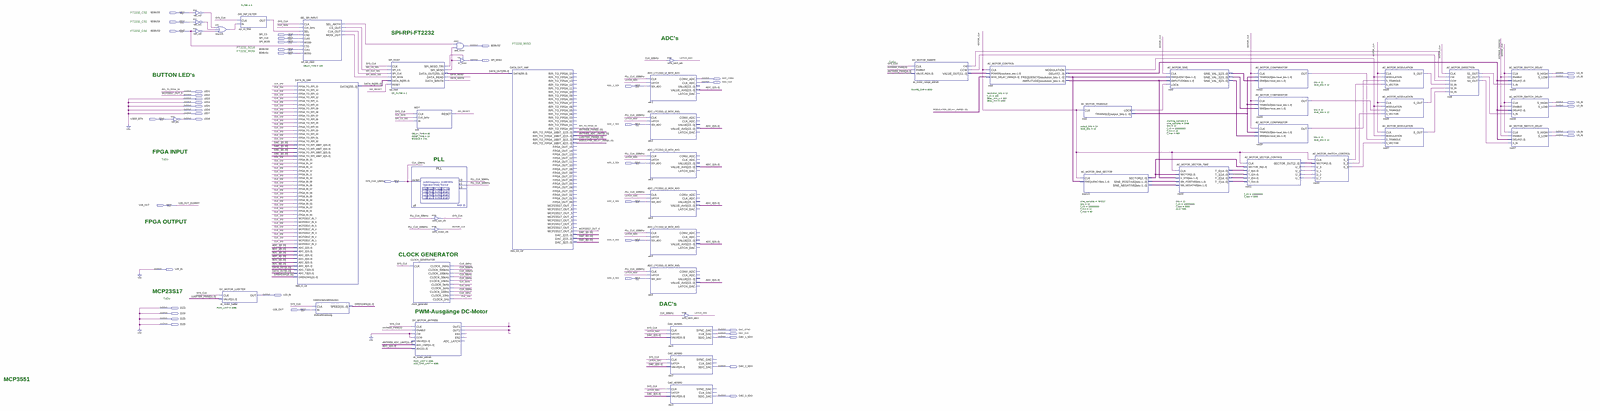
[diagram p0: schematic sheet, whole]
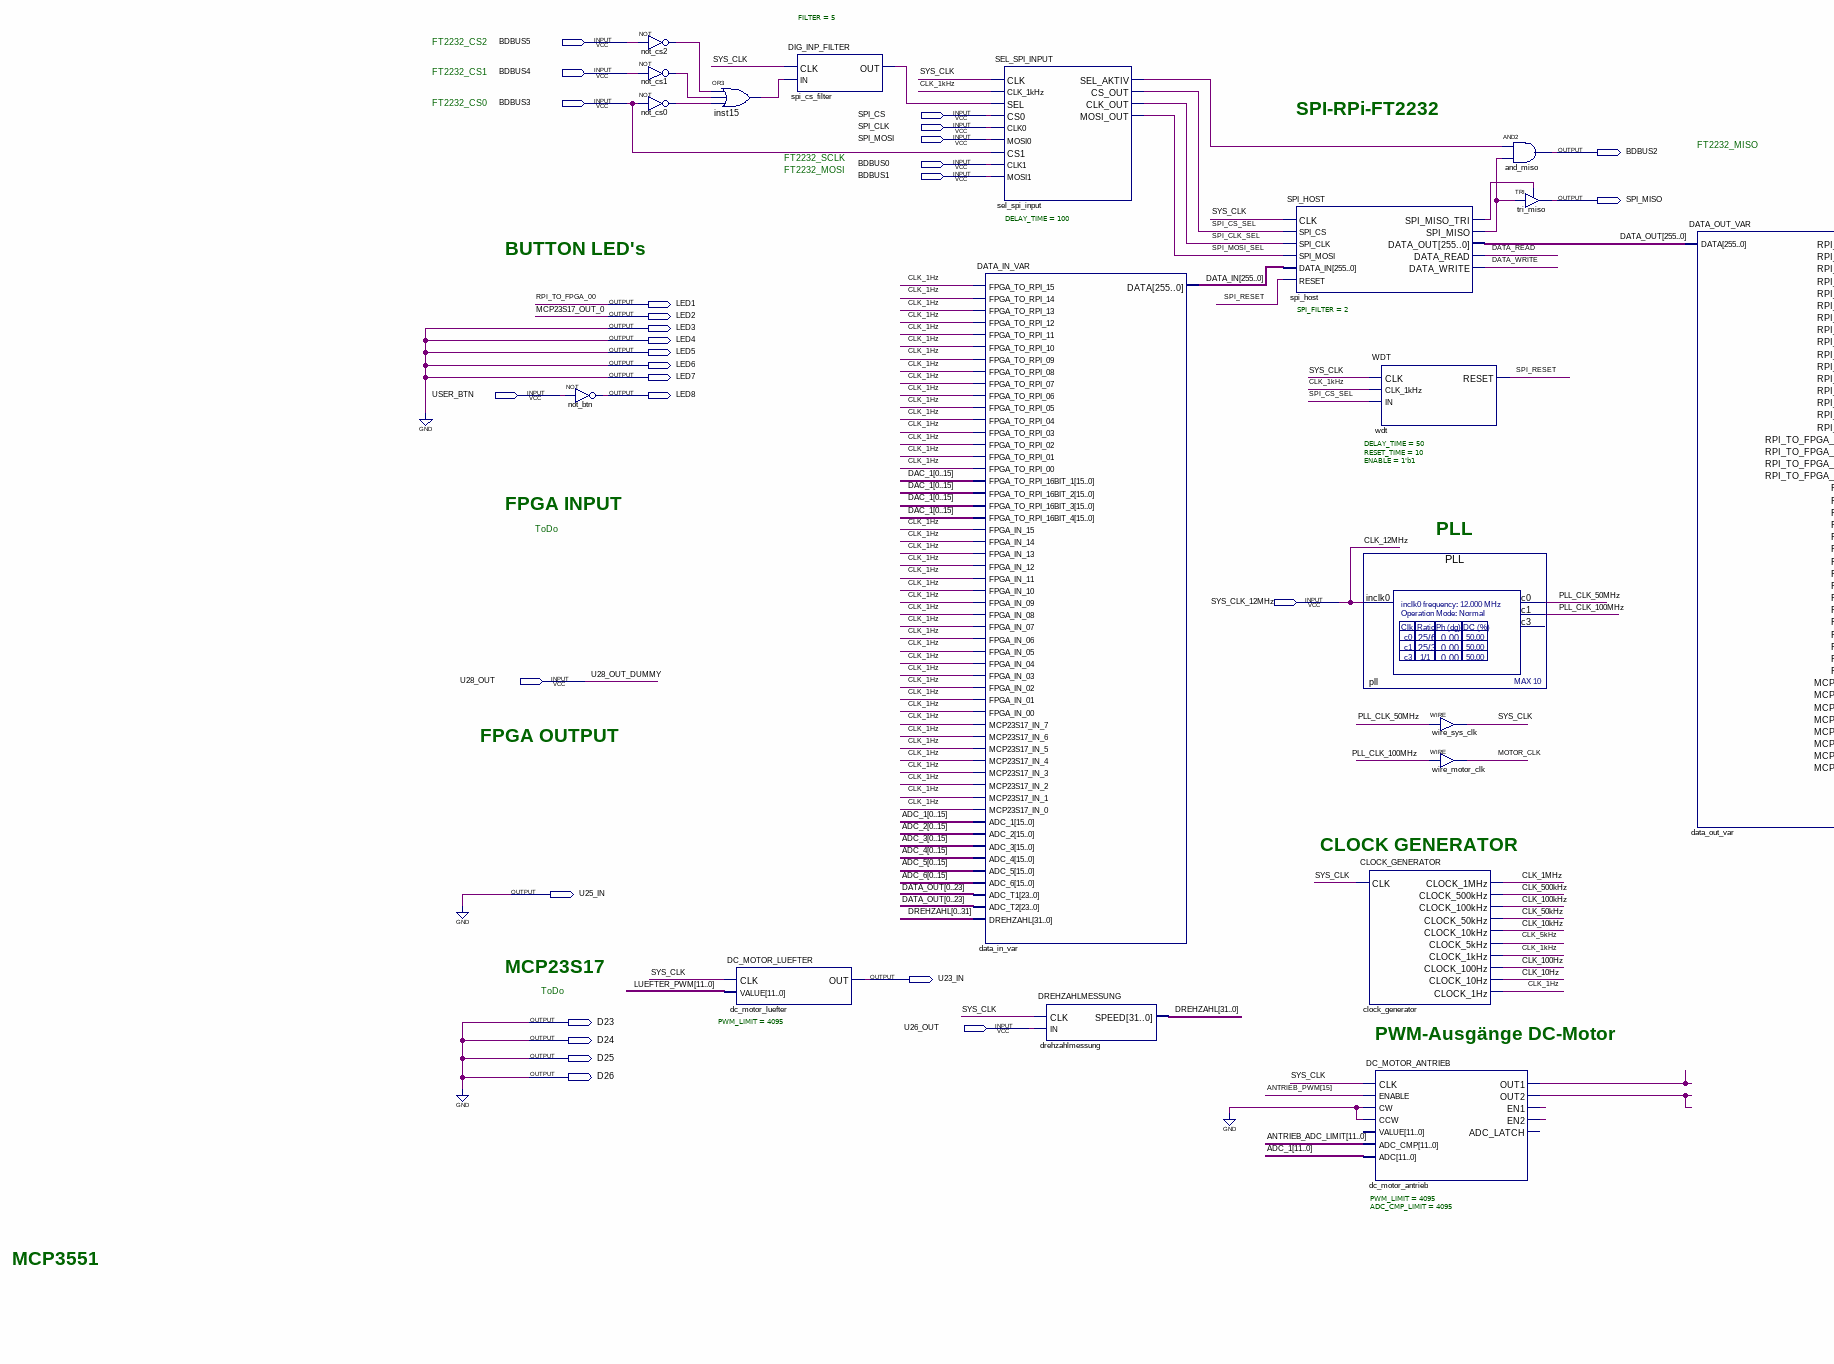
[diagram p1: schematic sheet, left part]
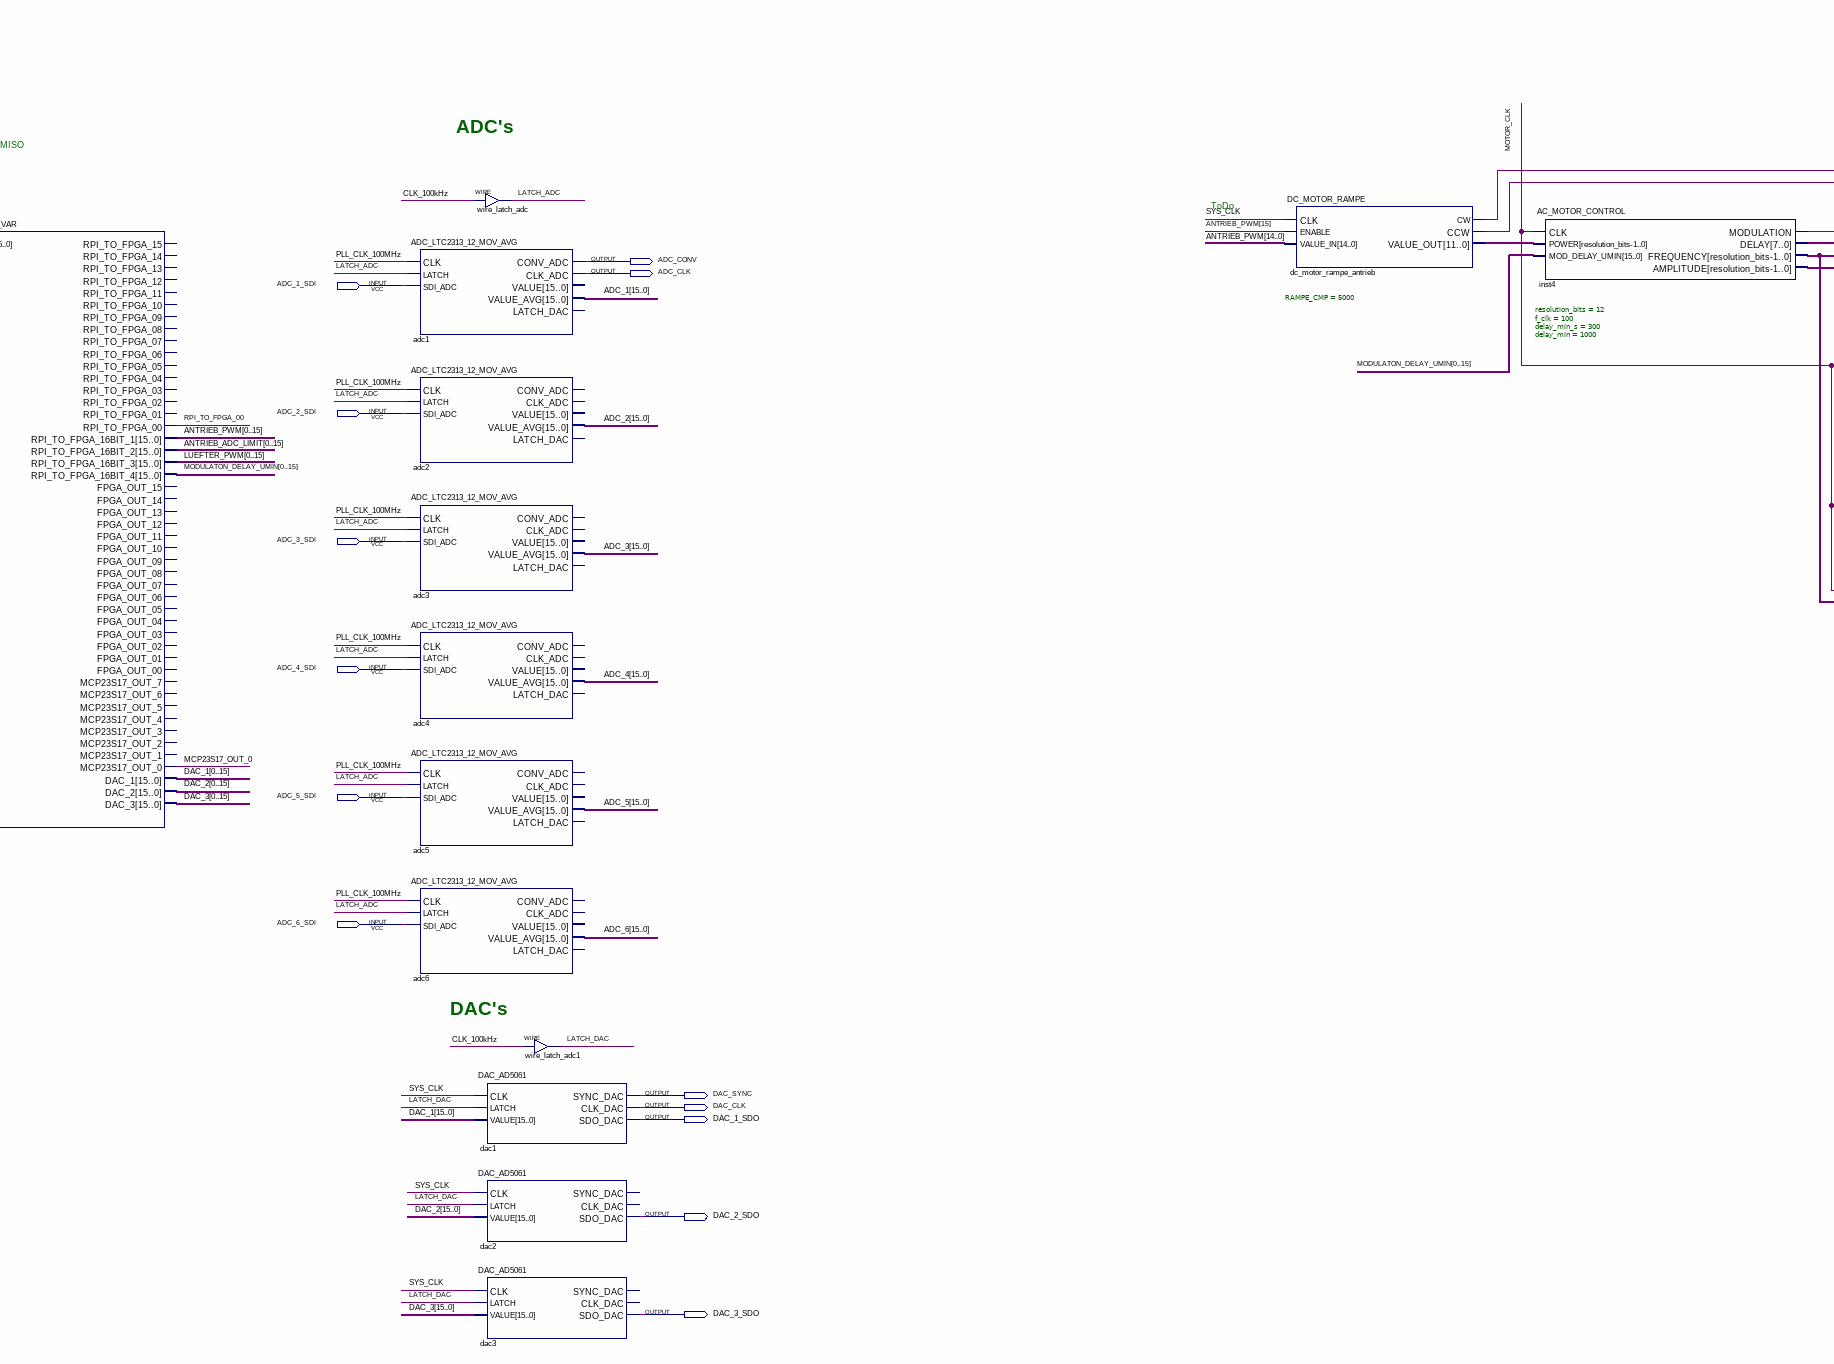
[diagram p2: schematic sheet, centre part]
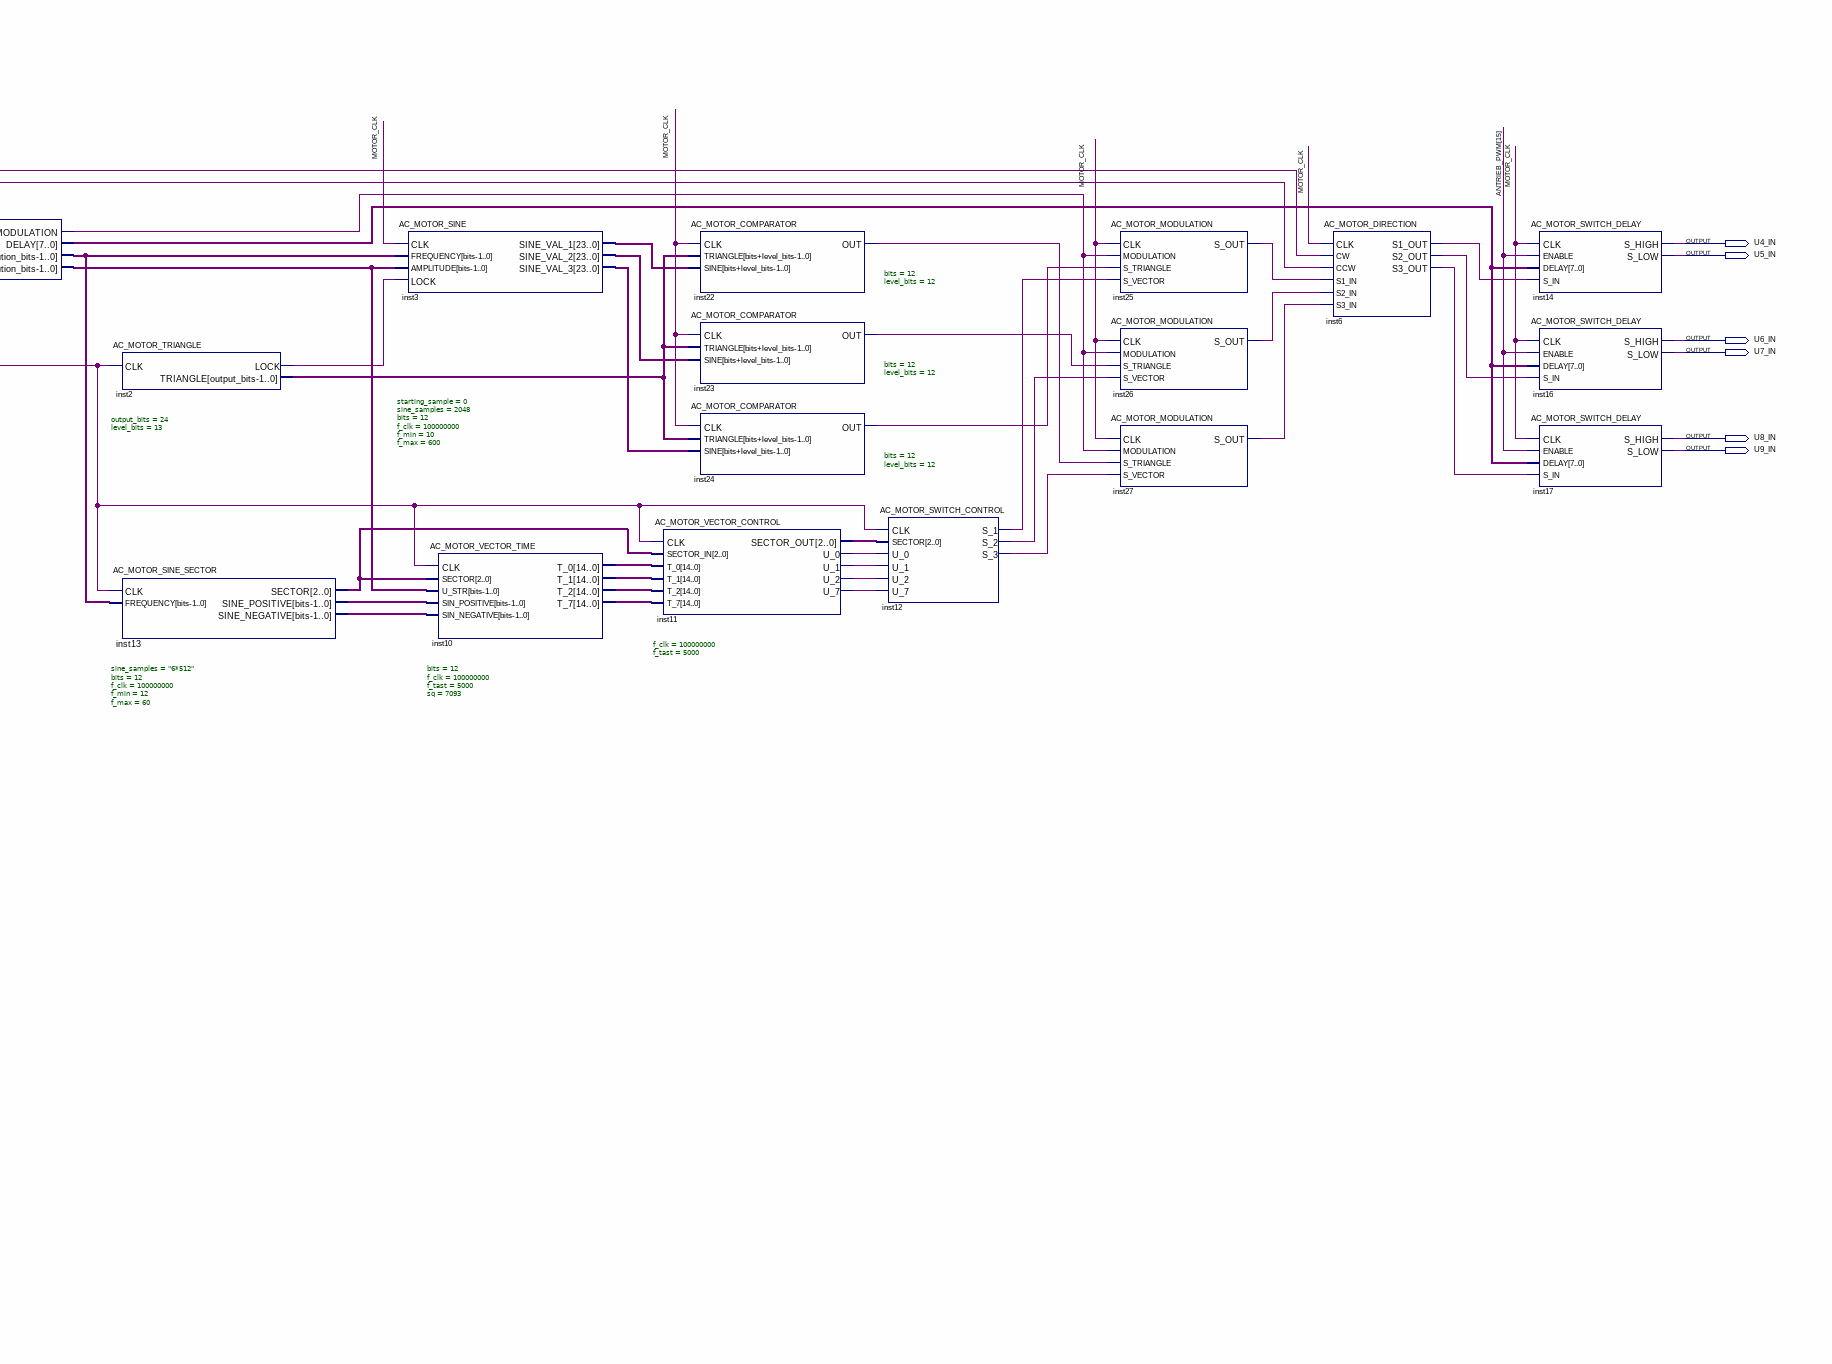
[diagram p3: schematic sheet, right part]
// Quartus schematic MAX1000.bdf as structural Verilog: 49 symbols, 47 pins
module MAX1000 (
  input  BDBUS5,
  input  BDBUS4,
  input  BDBUS3,
  input  SPI_CS,
  input  SPI_CLK,
  input  SPI_MOSI,
  input  BDBUS0,
  input  BDBUS1,
  input  ADC_1_SDI,
  input  USER_BTN,
  input  ADC_2_SDI,
  input  ADC_3_SDI,
  input  SYS_CLK_12MHz,
  input  ADC_4_SDI,
  input  U28_OUT,
  input  ADC_5_SDI,
  input  ADC_6_SDI,
  input  U26_OUT,
  output BDBUS2,
  output SPI_MISO,
  output U4_IN,
  output U5_IN,
  output ADC_CONV,
  output ADC_CLK,
  output LED1,
  output LED2,
  output LED3,
  output LED4,
  output U6_IN,
  output LED5,
  output U7_IN,
  output LED6,
  output LED7,
  output LED8,
  output U8_IN,
  output U9_IN,
  output U25_IN,
  output U23_IN,
  output D23,
  output D24,
  output D25,
  output D26,
  output DAC_SYNC,
  output DAC_CLK,
  output DAC_1_SDO,
  output DAC_2_SDO,
  output DAC_3_SDO
);

  wire CLK_1Hz, CLK_1kHz, CLK_1MHz, CLK_5kHz, CLK_10Hz, CLK_10kHz, CLK_50kHz, CLK_100Hz, CLK_100kHz,
       CLK_500kHz, DATA_READ, DATA_WRITE, dc_motor_antrieb_en1, dc_motor_antrieb_en2, dc_motor_antrieb_out1,
       dc_motor_antrieb_out2, dc_motor_rampe_antrieb_ccw, dc_motor_rampe_antrieb_cw, inst2_lock,
       inst4_modulation, inst6_s1_out, inst6_s2_out, inst6_s3_out, inst11_u_0, inst11_u_1, inst11_u_2,
       inst11_u_7, inst12_s_1, inst12_s_2, inst12_s_3, inst15_out, inst22_out, inst23_out, inst24_out,
       inst25_s_out, inst26_s_out, inst27_s_out, LATCH_ADC, LATCH_DAC, MOTOR_CLK, not_cs0_out, not_cs1_out,
       not_cs2_out, PLL_CLK_50MHz, PLL_CLK_100MHz, sel_spi_input_sel_aktiv, SPI_CLK_SEL, spi_cs_filter_out,
       SPI_CS_SEL, spi_host_spi_miso, spi_host_spi_miso_tri, SPI_MOSI_SEL, SPI_RESET, SYS_CLK;
  wire [2:0] inst11_sector_out, inst13_sector;
  wire [7:0] inst4_delay;
  wire [11:0] dc_motor_rampe_antrieb_value_out, inst4_amplitude, inst4_frequency, inst13_sine_negative,
       inst13_sine_positive;
  wire [14:0] inst10_t_0, inst10_t_1, inst10_t_2, inst10_t_7;
  wire [15:0] ADC_1, ADC_2, ADC_3, ADC_4, ADC_5, ADC_6, ANTRIEB_ADC_LIMIT, ANTRIEB_PWM, DAC_1, DAC_2, DAC_3,
       LUEFTER_PWM, MODULATON_DELAY_UMIN;
  wire [23:0] inst2_triangle, inst3_sine_val_1, inst3_sine_val_2, inst3_sine_val_3;
  wire [31:0] DREHZAHL;
  wire [255:0] DATA_IN, DATA_OUT;

  not not_btn (LED8, USER_BTN);
  not not_cs2 (not_cs2_out, BDBUS5);
  not not_cs1 (not_cs1_out, BDBUS4);
  not not_cs0 (not_cs0_out, BDBUS3);
  or inst15 (inst15_out, not_cs2_out, not_cs1_out, not_cs0_out);
  DC_MOTOR_LUEFTER #(.PWM_LIMIT(4095)) dc_motor_luefter (.CLK(SYS_CLK), .VALUE(LUEFTER_PWM[11:0]), .OUT(U23_IN));
  DIG_INP_FILTER #(.FILTER(5)) spi_cs_filter (.CLK(SYS_CLK), .IN(inst15_out), .OUT(spi_cs_filter_out));
  SEL_SPI_INPUT #(.DELAY_TIME(100)) sel_spi_input (
    .CLK(SYS_CLK), .CLK_1kHz(CLK_1kHz), .SEL(spi_cs_filter_out), .CS0(SPI_CS), .CLK0(SPI_CLK),
    .MOSI0(SPI_MOSI), .CS1(BDBUS3), .CLK1(BDBUS0), .MOSI1(BDBUS1), .SEL_AKTIV(sel_spi_input_sel_aktiv),
    .CS_OUT(SPI_CS_SEL), .CLK_OUT(SPI_CLK_SEL), .MOSI_OUT(SPI_MOSI_SEL));
  DATA_IN_VAR data_in_var (
    .FPGA_TO_RPI_15(CLK_1Hz), .FPGA_TO_RPI_14(CLK_1Hz), .FPGA_TO_RPI_13(CLK_1Hz), .FPGA_TO_RPI_12(CLK_1Hz),
    .FPGA_TO_RPI_11(CLK_1Hz), .FPGA_TO_RPI_10(CLK_1Hz), .FPGA_TO_RPI_09(CLK_1Hz), .FPGA_TO_RPI_08(CLK_1Hz),
    .FPGA_TO_RPI_07(CLK_1Hz), .FPGA_TO_RPI_06(CLK_1Hz), .FPGA_TO_RPI_05(CLK_1Hz), .FPGA_TO_RPI_04(CLK_1Hz),
    .FPGA_TO_RPI_03(CLK_1Hz), .FPGA_TO_RPI_02(CLK_1Hz), .FPGA_TO_RPI_01(CLK_1Hz), .FPGA_TO_RPI_00(CLK_1Hz),
    .FPGA_TO_RPI_16BIT_1({DAC_1[0], DAC_1[1], DAC_1[2], DAC_1[3], DAC_1[4], DAC_1[5], DAC_1[6], DAC_1[7], DAC_1[8], DAC_1[9], DAC_1[10], DAC_1[11], DAC_1[12], DAC_1[13], DAC_1[14], DAC_1[15]}),
    .FPGA_TO_RPI_16BIT_2({DAC_1[0], DAC_1[1], DAC_1[2], DAC_1[3], DAC_1[4], DAC_1[5], DAC_1[6], DAC_1[7], DAC_1[8], DAC_1[9], DAC_1[10], DAC_1[11], DAC_1[12], DAC_1[13], DAC_1[14], DAC_1[15]}),
    .FPGA_TO_RPI_16BIT_3({DAC_1[0], DAC_1[1], DAC_1[2], DAC_1[3], DAC_1[4], DAC_1[5], DAC_1[6], DAC_1[7], DAC_1[8], DAC_1[9], DAC_1[10], DAC_1[11], DAC_1[12], DAC_1[13], DAC_1[14], DAC_1[15]}),
    .FPGA_TO_RPI_16BIT_4({DAC_1[0], DAC_1[1], DAC_1[2], DAC_1[3], DAC_1[4], DAC_1[5], DAC_1[6], DAC_1[7], DAC_1[8], DAC_1[9], DAC_1[10], DAC_1[11], DAC_1[12], DAC_1[13], DAC_1[14], DAC_1[15]}),
    .FPGA_IN_15(CLK_1Hz), .FPGA_IN_14(CLK_1Hz), .FPGA_IN_13(CLK_1Hz), .FPGA_IN_12(CLK_1Hz),
    .FPGA_IN_11(CLK_1Hz), .FPGA_IN_10(CLK_1Hz), .FPGA_IN_09(CLK_1Hz), .FPGA_IN_08(CLK_1Hz),
    .FPGA_IN_07(CLK_1Hz), .FPGA_IN_06(CLK_1Hz), .FPGA_IN_05(CLK_1Hz), .FPGA_IN_04(CLK_1Hz),
    .FPGA_IN_03(CLK_1Hz), .FPGA_IN_02(CLK_1Hz), .FPGA_IN_01(CLK_1Hz), .FPGA_IN_00(CLK_1Hz),
    .MCP23S17_IN_7(CLK_1Hz), .MCP23S17_IN_6(CLK_1Hz), .MCP23S17_IN_5(CLK_1Hz), .MCP23S17_IN_4(CLK_1Hz),
    .MCP23S17_IN_3(CLK_1Hz), .MCP23S17_IN_2(CLK_1Hz), .MCP23S17_IN_1(CLK_1Hz), .MCP23S17_IN_0(CLK_1Hz),
    .ADC_1({ADC_1[0], ADC_1[1], ADC_1[2], ADC_1[3], ADC_1[4], ADC_1[5], ADC_1[6], ADC_1[7], ADC_1[8], ADC_1[9], ADC_1[10], ADC_1[11], ADC_1[12], ADC_1[13], ADC_1[14], ADC_1[15]}),
    .ADC_2({ADC_2[0], ADC_2[1], ADC_2[2], ADC_2[3], ADC_2[4], ADC_2[5], ADC_2[6], ADC_2[7], ADC_2[8], ADC_2[9], ADC_2[10], ADC_2[11], ADC_2[12], ADC_2[13], ADC_2[14], ADC_2[15]}),
    .ADC_3({ADC_3[0], ADC_3[1], ADC_3[2], ADC_3[3], ADC_3[4], ADC_3[5], ADC_3[6], ADC_3[7], ADC_3[8], ADC_3[9], ADC_3[10], ADC_3[11], ADC_3[12], ADC_3[13], ADC_3[14], ADC_3[15]}),
    .ADC_4({ADC_4[0], ADC_4[1], ADC_4[2], ADC_4[3], ADC_4[4], ADC_4[5], ADC_4[6], ADC_4[7], ADC_4[8], ADC_4[9], ADC_4[10], ADC_4[11], ADC_4[12], ADC_4[13], ADC_4[14], ADC_4[15]}),
    .ADC_5({ADC_5[0], ADC_5[1], ADC_5[2], ADC_5[3], ADC_5[4], ADC_5[5], ADC_5[6], ADC_5[7], ADC_5[8], ADC_5[9], ADC_5[10], ADC_5[11], ADC_5[12], ADC_5[13], ADC_5[14], ADC_5[15]}),
    .ADC_6({ADC_6[0], ADC_6[1], ADC_6[2], ADC_6[3], ADC_6[4], ADC_6[5], ADC_6[6], ADC_6[7], ADC_6[8], ADC_6[9], ADC_6[10], ADC_6[11], ADC_6[12], ADC_6[13], ADC_6[14], ADC_6[15]}),
    .ADC_T1({DATA_OUT[0], DATA_OUT[1], DATA_OUT[2], DATA_OUT[3], DATA_OUT[4], DATA_OUT[5], DATA_OUT[6], DATA_OUT[7], DATA_OUT[8], DATA_OUT[9], DATA_OUT[10], DATA_OUT[11], DATA_OUT[12], DATA_OUT[13], DATA_OUT[14], DATA_OUT[15], DATA_OUT[16], DATA_OUT[17], DATA_OUT[18], DATA_OUT[19], DATA_OUT[20], DATA_OUT[21], DATA_OUT[22], DATA_OUT[23]}),
    .ADC_T2({DATA_OUT[0], DATA_OUT[1], DATA_OUT[2], DATA_OUT[3], DATA_OUT[4], DATA_OUT[5], DATA_OUT[6], DATA_OUT[7], DATA_OUT[8], DATA_OUT[9], DATA_OUT[10], DATA_OUT[11], DATA_OUT[12], DATA_OUT[13], DATA_OUT[14], DATA_OUT[15], DATA_OUT[16], DATA_OUT[17], DATA_OUT[18], DATA_OUT[19], DATA_OUT[20], DATA_OUT[21], DATA_OUT[22], DATA_OUT[23]}),
    .DREHZAHL({DREHZAHL[0], DREHZAHL[1], DREHZAHL[2], DREHZAHL[3], DREHZAHL[4], DREHZAHL[5], DREHZAHL[6], DREHZAHL[7], DREHZAHL[8], DREHZAHL[9], DREHZAHL[10], DREHZAHL[11], DREHZAHL[12], DREHZAHL[13], DREHZAHL[14], DREHZAHL[15], DREHZAHL[16], DREHZAHL[17], DREHZAHL[18], DREHZAHL[19], DREHZAHL[20], DREHZAHL[21], DREHZAHL[22], DREHZAHL[23], DREHZAHL[24], DREHZAHL[25], DREHZAHL[26], DREHZAHL[27], DREHZAHL[28], DREHZAHL[29], DREHZAHL[30], DREHZAHL[31]}),
    .DATA(DATA_IN));
  DREHZAHLMESSUNG drehzahlmessung (.CLK(SYS_CLK), .IN(U26_OUT), .SPEED(DREHZAHL));
  SPI_HOST #(.SPI_FILTER(2)) spi_host (
    .CLK(SYS_CLK), .SPI_CS(SPI_CS_SEL), .SPI_CLK(SPI_CLK_SEL), .SPI_MOSI(SPI_MOSI_SEL), .DATA_IN(DATA_IN),
    .RESET(SPI_RESET), .SPI_MISO_TRI(spi_host_spi_miso_tri), .SPI_MISO(spi_host_spi_miso),
    .DATA_OUT(DATA_OUT), .DATA_READ(DATA_READ), .DATA_WRITE(DATA_WRITE));
  WDT #(.DELAY_TIME(50), .RESET_TIME(10), .ENABLE(1'b1)) wdt (
    .CLK(SYS_CLK), .CLK_1kHz(CLK_1kHz), .IN(SPI_CS_SEL), .RESET(SPI_RESET));
  PLL pll (.inclk0(SYS_CLK_12MHz), .c0(PLL_CLK_50MHz), .c1(PLL_CLK_100MHz));  // open: c3
  CLOCK_GENERATOR clock_generator (
    .CLK(SYS_CLK), .CLOCK_1MHz(CLK_1MHz), .CLOCK_500kHz(CLK_500kHz), .CLOCK_100kHz(CLK_100kHz),
    .CLOCK_50kHz(CLK_50kHz), .CLOCK_10kHz(CLK_10kHz), .CLOCK_5kHz(CLK_5kHz), .CLOCK_1kHz(CLK_1kHz),
    .CLOCK_100Hz(CLK_100Hz), .CLOCK_10Hz(CLK_10Hz), .CLOCK_1Hz(CLK_1Hz));
  DC_MOTOR_ANTRIEB #(.PWM_LIMIT(4095), .ADC_CMP_LIMIT(4095)) dc_motor_antrieb (
    .CLK(SYS_CLK), .ENABLE(ANTRIEB_PWM[15]), .CW(1'b0), .CCW(1'b0), .ADC_CMP(ANTRIEB_ADC_LIMIT[11:0]),
    .ADC(ADC_1[11:0]), .OUT1(dc_motor_antrieb_out1), .OUT2(dc_motor_antrieb_out2),
    .EN1(dc_motor_antrieb_en1), .EN2(dc_motor_antrieb_en2));  // open: VALUE, ADC_LATCH
  assign SYS_CLK = PLL_CLK_50MHz;  // WIRE wire_sys_clk
  assign MOTOR_CLK = PLL_CLK_100MHz;  // WIRE wire_motor_clk
  and and_miso (BDBUS2, sel_spi_input_sel_aktiv, spi_host_spi_miso);
  TRI tri_miso (.IN(spi_host_spi_miso), .OE(spi_host_spi_miso_tri), .OUT(SPI_MISO));
  DATA_OUT_VAR data_out_var (
    .DATA(DATA_OUT), .RPI_TO_FPGA_00(LED1),
    .RPI_TO_FPGA_16BIT_1({ANTRIEB_PWM[0], ANTRIEB_PWM[1], ANTRIEB_PWM[2], ANTRIEB_PWM[3], ANTRIEB_PWM[4], ANTRIEB_PWM[5], ANTRIEB_PWM[6], ANTRIEB_PWM[7], ANTRIEB_PWM[8], ANTRIEB_PWM[9], ANTRIEB_PWM[10], ANTRIEB_PWM[11], ANTRIEB_PWM[12], ANTRIEB_PWM[13], ANTRIEB_PWM[14], ANTRIEB_PWM[15]}),
    .RPI_TO_FPGA_16BIT_2({ANTRIEB_ADC_LIMIT[0], ANTRIEB_ADC_LIMIT[1], ANTRIEB_ADC_LIMIT[2], ANTRIEB_ADC_LIMIT[3], ANTRIEB_ADC_LIMIT[4], ANTRIEB_ADC_LIMIT[5], ANTRIEB_ADC_LIMIT[6], ANTRIEB_ADC_LIMIT[7], ANTRIEB_ADC_LIMIT[8], ANTRIEB_ADC_LIMIT[9], ANTRIEB_ADC_LIMIT[10], ANTRIEB_ADC_LIMIT[11], ANTRIEB_ADC_LIMIT[12], ANTRIEB_ADC_LIMIT[13], ANTRIEB_ADC_LIMIT[14], ANTRIEB_ADC_LIMIT[15]}),
    .RPI_TO_FPGA_16BIT_3({LUEFTER_PWM[0], LUEFTER_PWM[1], LUEFTER_PWM[2], LUEFTER_PWM[3], LUEFTER_PWM[4], LUEFTER_PWM[5], LUEFTER_PWM[6], LUEFTER_PWM[7], LUEFTER_PWM[8], LUEFTER_PWM[9], LUEFTER_PWM[10], LUEFTER_PWM[11], LUEFTER_PWM[12], LUEFTER_PWM[13], LUEFTER_PWM[14], LUEFTER_PWM[15]}),
    .RPI_TO_FPGA_16BIT_4({MODULATON_DELAY_UMIN[0], MODULATON_DELAY_UMIN[1], MODULATON_DELAY_UMIN[2], MODULATON_DELAY_UMIN[3], MODULATON_DELAY_UMIN[4], MODULATON_DELAY_UMIN[5], MODULATON_DELAY_UMIN[6], MODULATON_DELAY_UMIN[7], MODULATON_DELAY_UMIN[8], MODULATON_DELAY_UMIN[9], MODULATON_DELAY_UMIN[10], MODULATON_DELAY_UMIN[11], MODULATON_DELAY_UMIN[12], MODULATON_DELAY_UMIN[13], MODULATON_DELAY_UMIN[14], MODULATON_DELAY_UMIN[15]}),
    .MCP23S17_OUT_0(LED2),
    .DAC_1({DAC_1[0], DAC_1[1], DAC_1[2], DAC_1[3], DAC_1[4], DAC_1[5], DAC_1[6], DAC_1[7], DAC_1[8], DAC_1[9], DAC_1[10], DAC_1[11], DAC_1[12], DAC_1[13], DAC_1[14], DAC_1[15]}),
    .DAC_2({DAC_2[0], DAC_2[1], DAC_2[2], DAC_2[3], DAC_2[4], DAC_2[5], DAC_2[6], DAC_2[7], DAC_2[8], DAC_2[9], DAC_2[10], DAC_2[11], DAC_2[12], DAC_2[13], DAC_2[14], DAC_2[15]}),
    .DAC_3({DAC_3[0], DAC_3[1], DAC_3[2], DAC_3[3], DAC_3[4], DAC_3[5], DAC_3[6], DAC_3[7], DAC_3[8], DAC_3[9], DAC_3[10], DAC_3[11], DAC_3[12], DAC_3[13], DAC_3[14], DAC_3[15]}));  // open: RPI_TO_FPGA_15, RPI_TO_FPGA_14, RPI_TO_FPGA_13, RPI_TO_FPGA_12, RPI_TO_FPGA_11, RPI_TO_FPGA_10, RPI_TO_FPGA_09, RPI_TO_FPGA_08, RPI_TO_FPGA_07, RPI_TO_FPGA_06, RPI_TO_FPGA_05, RPI_TO_FPGA_04, RPI_TO_FPGA_03, RPI_TO_FPGA_02, RPI_TO_FPGA_01, FPGA_OUT_15, FPGA_OUT_14, FPGA_OUT_13, FPGA_OUT_12, FPGA_OUT_11, FPGA_OUT_10, FPGA_OUT_09, FPGA_OUT_08, FPGA_OUT_07, FPGA_OUT_06, FPGA_OUT_05, FPGA_OUT_04, FPGA_OUT_03, FPGA_OUT_02, FPGA_OUT_01, FPGA_OUT_00, MCP23S17_OUT_7, MCP23S17_OUT_6, MCP23S17_OUT_5, MCP23S17_OUT_4, MCP23S17_OUT_3, MCP23S17_OUT_2, MCP23S17_OUT_1
  ADC_LTC2313_12_MOV_AVG adc1 (
    .CLK(PLL_CLK_100MHz), .LATCH(LATCH_ADC), .SDI_ADC(ADC_1_SDI), .CONV_ADC(ADC_CONV), .CLK_ADC(ADC_CLK),
    .VALUE_AVG(ADC_1));  // open: VALUE, LATCH_DAC
  ADC_LTC2313_12_MOV_AVG adc2 (
    .CLK(PLL_CLK_100MHz), .LATCH(LATCH_ADC), .SDI_ADC(ADC_2_SDI), .VALUE_AVG(ADC_2));  // open: CONV_ADC, CLK_ADC, VALUE, LATCH_DAC
  ADC_LTC2313_12_MOV_AVG adc3 (
    .CLK(PLL_CLK_100MHz), .LATCH(LATCH_ADC), .SDI_ADC(ADC_3_SDI), .VALUE_AVG(ADC_3));  // open: CONV_ADC, CLK_ADC, VALUE, LATCH_DAC
  ADC_LTC2313_12_MOV_AVG adc4 (
    .CLK(PLL_CLK_100MHz), .LATCH(LATCH_ADC), .SDI_ADC(ADC_4_SDI), .VALUE_AVG(ADC_4));  // open: CONV_ADC, CLK_ADC, VALUE, LATCH_DAC
  ADC_LTC2313_12_MOV_AVG adc5 (
    .CLK(PLL_CLK_100MHz), .LATCH(LATCH_ADC), .SDI_ADC(ADC_5_SDI), .VALUE_AVG(ADC_5));  // open: CONV_ADC, CLK_ADC, VALUE, LATCH_DAC
  ADC_LTC2313_12_MOV_AVG adc6 (
    .CLK(PLL_CLK_100MHz), .LATCH(LATCH_ADC), .SDI_ADC(ADC_6_SDI), .VALUE_AVG(ADC_6));  // open: CONV_ADC, CLK_ADC, VALUE, LATCH_DAC
  assign LATCH_ADC = CLK_100kHz;  // WIRE wire_latch_adc
  DAC_AD5061 dac1 (
    .CLK(SYS_CLK), .LATCH(LATCH_DAC), .VALUE(DAC_1), .SYNC_DAC(DAC_SYNC), .CLK_DAC(DAC_CLK),
    .SDO_DAC(DAC_1_SDO));
  DAC_AD5061 dac2 (.CLK(SYS_CLK), .LATCH(LATCH_DAC), .VALUE(DAC_2), .SDO_DAC(DAC_2_SDO));  // open: SYNC_DAC, CLK_DAC
  DAC_AD5061 dac3 (.CLK(SYS_CLK), .LATCH(LATCH_DAC), .VALUE(DAC_3), .SDO_DAC(DAC_3_SDO));  // open: SYNC_DAC, CLK_DAC
  assign LATCH_DAC = CLK_100kHz;  // WIRE wire_latch_adc1
  DC_MOTOR_RAMPE #(.RAMPE_CMP(5000)) dc_motor_rampe_antrieb (
    .CLK(SYS_CLK), .ENABLE(ANTRIEB_PWM[15]), .VALUE_IN(ANTRIEB_PWM[14:0]), .CW(dc_motor_rampe_antrieb_cw),
    .CCW(dc_motor_rampe_antrieb_ccw), .VALUE_OUT(dc_motor_rampe_antrieb_value_out));
  AC_MOTOR_CONTROL #(.resolution_bits(12), .f_clk(100), .delay_min_s(300), .delay_min(1000)) inst4 (
    .CLK(MOTOR_CLK), .POWER(dc_motor_rampe_antrieb_value_out),
    .MOD_DELAY_UMIN({MODULATON_DELAY_UMIN[0], MODULATON_DELAY_UMIN[1], MODULATON_DELAY_UMIN[2], MODULATON_DELAY_UMIN[3], MODULATON_DELAY_UMIN[4], MODULATON_DELAY_UMIN[5], MODULATON_DELAY_UMIN[6], MODULATON_DELAY_UMIN[7], MODULATON_DELAY_UMIN[8], MODULATON_DELAY_UMIN[9], MODULATON_DELAY_UMIN[10], MODULATON_DELAY_UMIN[11], MODULATON_DELAY_UMIN[12], MODULATON_DELAY_UMIN[13], MODULATON_DELAY_UMIN[14], MODULATON_DELAY_UMIN[15]}),
    .MODULATION(inst4_modulation), .DELAY(inst4_delay), .FREQUENCY(inst4_frequency),
    .AMPLITUDE(inst4_amplitude));
  AC_MOTOR_TRIANGLE #(.output_bits(24), .level_bits(13)) inst2 (
    .CLK(MOTOR_CLK), .LOCK(inst2_lock), .TRIANGLE(inst2_triangle));
  AC_MOTOR_SINE_SECTOR #(.sine_samples("6*512"), .bits(12), .f_clk(100000000), .f_min(12), .f_max(60)) inst13 (
    .CLK(MOTOR_CLK), .FREQUENCY(inst4_frequency), .SECTOR(inst13_sector),
    .SINE_POSITIVE(inst13_sine_positive), .SINE_NEGATIVE(inst13_sine_negative));
  AC_MOTOR_SINE #(.starting_sample(0), .sine_samples(2048), .bits(12), .f_clk(100000000), .f_min(10), .f_max(600)) inst3 (
    .CLK(MOTOR_CLK), .FREQUENCY(inst4_frequency), .AMPLITUDE(inst4_amplitude), .LOCK(inst2_lock),
    .SINE_VAL_1(inst3_sine_val_1), .SINE_VAL_2(inst3_sine_val_2), .SINE_VAL_3(inst3_sine_val_3));
  AC_MOTOR_VECTOR_TIME #(.bits(12), .f_clk(100000000), .f_tast(5000), .sq(7093)) inst10 (
    .CLK(MOTOR_CLK), .SECTOR(inst13_sector), .U_STR(inst4_amplitude), .SIN_POSITIVE(inst13_sine_positive),
    .SIN_NEGATIVE(inst13_sine_negative), .T_0(inst10_t_0), .T_1(inst10_t_1), .T_2(inst10_t_2),
    .T_7(inst10_t_7));
  AC_MOTOR_COMPARATOR #(.bits(12), .level_bits(12)) inst22 (
    .CLK(MOTOR_CLK), .TRIANGLE(inst2_triangle), .SINE(inst3_sine_val_1), .OUT(inst22_out));
  AC_MOTOR_COMPARATOR #(.bits(12), .level_bits(12)) inst23 (
    .CLK(MOTOR_CLK), .TRIANGLE(inst2_triangle), .SINE(inst3_sine_val_2), .OUT(inst23_out));
  AC_MOTOR_COMPARATOR #(.bits(12), .level_bits(12)) inst24 (
    .CLK(MOTOR_CLK), .TRIANGLE(inst2_triangle), .SINE(inst3_sine_val_3), .OUT(inst24_out));
  AC_MOTOR_VECTOR_CONTROL #(.f_clk(100000000), .f_tast(5000)) inst11 (
    .CLK(MOTOR_CLK), .SECTOR_IN(inst13_sector), .T_0(inst10_t_0), .T_1(inst10_t_1), .T_2(inst10_t_2),
    .T_7(inst10_t_7), .SECTOR_OUT(inst11_sector_out), .U_0(inst11_u_0), .U_1(inst11_u_1), .U_2(inst11_u_2),
    .U_7(inst11_u_7));
  AC_MOTOR_SWITCH_CONTROL inst12 (
    .CLK(MOTOR_CLK), .SECTOR(inst11_sector_out), .U_0(inst11_u_0), .U_1(inst11_u_1), .U_2(inst11_u_2),
    .U_7(inst11_u_7), .S_1(inst12_s_1), .S_2(inst12_s_2), .S_3(inst12_s_3));
  AC_MOTOR_MODULATION inst25 (
    .CLK(MOTOR_CLK), .MODULATION(inst4_modulation), .S_TRIANGLE(inst24_out), .S_VECTOR(inst12_s_1),
    .S_OUT(inst25_s_out));
  AC_MOTOR_MODULATION inst26 (
    .CLK(MOTOR_CLK), .MODULATION(inst4_modulation), .S_TRIANGLE(inst23_out), .S_VECTOR(inst12_s_2),
    .S_OUT(inst26_s_out));
  AC_MOTOR_MODULATION inst27 (
    .CLK(MOTOR_CLK), .MODULATION(inst4_modulation), .S_TRIANGLE(inst22_out), .S_VECTOR(inst12_s_3),
    .S_OUT(inst27_s_out));
  AC_MOTOR_DIRECTION inst6 (
    .CLK(MOTOR_CLK), .CW(dc_motor_rampe_antrieb_cw), .CCW(dc_motor_rampe_antrieb_ccw), .S1_IN(inst25_s_out),
    .S2_IN(inst26_s_out), .S3_IN(inst27_s_out), .S1_OUT(inst6_s1_out), .S2_OUT(inst6_s2_out),
    .S3_OUT(inst6_s3_out));
  AC_MOTOR_SWITCH_DELAY inst14 (
    .CLK(MOTOR_CLK), .ENABLE(ANTRIEB_PWM[15]), .DELAY(inst4_delay), .S_IN(inst6_s1_out), .S_HIGH(U4_IN),
    .S_LOW(U5_IN));
  AC_MOTOR_SWITCH_DELAY inst16 (
    .CLK(MOTOR_CLK), .ENABLE(ANTRIEB_PWM[15]), .DELAY(inst4_delay), .S_IN(inst6_s2_out), .S_HIGH(U6_IN),
    .S_LOW(U7_IN));
  AC_MOTOR_SWITCH_DELAY inst17 (
    .CLK(MOTOR_CLK), .ENABLE(ANTRIEB_PWM[15]), .DELAY(inst4_delay), .S_IN(inst6_s3_out), .S_HIGH(U8_IN),
    .S_LOW(U9_IN));

  assign D23 = 1'b0;
  assign D24 = 1'b0;
  assign D25 = 1'b0;
  assign D26 = 1'b0;
  assign LED3 = 1'b0;
  assign LED4 = 1'b0;
  assign LED5 = 1'b0;
  assign LED6 = 1'b0;
  assign LED7 = 1'b0;
  assign U25_IN = 1'b0;

  // Other names for the same wires on the sheet: MCP23S17_OUT_0 = LED2; RPI_TO_FPGA_00 = LED1;
  //   CLK_12MHz = SYS_CLK_12MHz; U28_OUT_DUMMY = U28_OUT

  // Notes on the sheet:
  //   FT2232_CS2
  //   FT2232_CS1
  //   FT2232_CS0
  //   SPI-RPi-FT2232
  //   ADC's
  //   FT2232_MISO
  //   FT2232_SCLK
  //   FT2232_MOSI
  //   ToDo
  //   BUTTON LED's
  //   FPGA INPUT
  //   PLL
  //   ToDo
  //   FPGA OUTPUT
  //   CLOCK GENERATOR
  //   MCP23S17
  //   ToDo
  //   DAC's
  //   PWM-Ausgänge DC-Motor 
  //   MCP3551
endmodule
